# EAGLE design gant_indus_050213 (EAGLE 5.12)
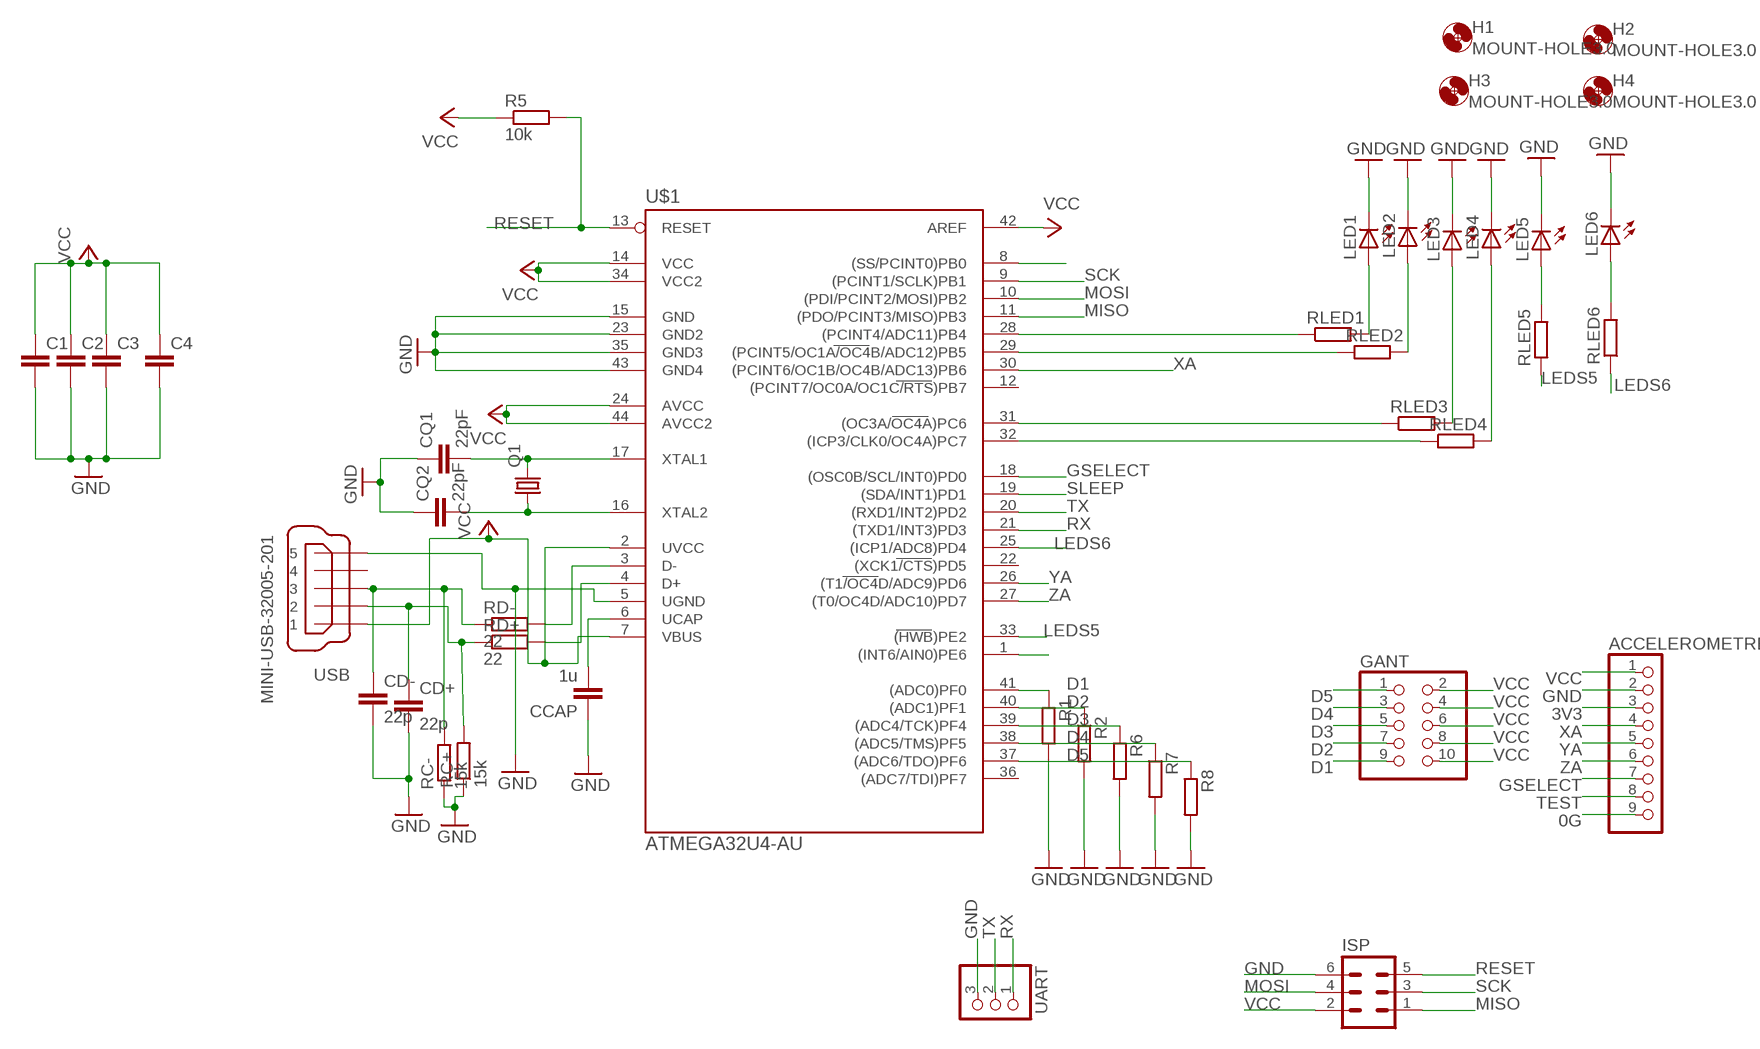
[diagram p0: schematic, sheet 1]

## Parts
ACCELEROMETRE  PINHD-1X9  [1X09]
C1  C-EUC0805  [C0805]
C2  C-EUC0805  [C0805]
C3  C-EUC0805  [C0805]
C4  C-EUC0805  [C0805]
CCAP  1u  C-EUC0805  [C0805]
CD+  22p  C-EUC0805  [C0805]
CD-  22p  C-EUC0805  [C0805]
CQ1  22pF  C-EUC0805  [C0805]
CQ2  22pF  C-EUC0805  [C0805]
GANT  PINHD-2X5/90  [2X05/90]
H1  MOUNT-HOLE3.0  [3,0]
H2  MOUNT-HOLE3.0  [3,0]
H3  MOUNT-HOLE3.0  [3,0]
H4  MOUNT-HOLE3.0  [3,0]
ISP  ML6L  [ML6L]
LED1  LEDCHIP-LED0805  [CHIP-LED0805]
LED2  LEDCHIP-LED0805  [CHIP-LED0805]
LED3  LEDCHIP-LED0805  [CHIP-LED0805]
LED4  LEDCHIP-LED0805  [CHIP-LED0805]
LED5  LEDCHIP-LED0805  [CHIP-LED0805]
LED6  LEDCHIP-LED0805  [CHIP-LED0805]
Q1  CRYSTALHC49U70  [HC49U70]
R1  R-EU_R0805  [R0805]
R2  R-EU_R0805  [R0805]
R5  10k  R-EU_R0805  [R0805]
R6  R-EU_R0805  [R0805]
R7  R-EU_R0805  [R0805]
R8  R-EU_R0805  [R0805]
RC+  15k  R-EU_M0805  [M0805]
RC-  15k  R-EU_M0805  [M0805]
RD+  22  R-EU_M0805  [M0805]
RD-  22  R-EU_M0805  [M0805]
RLED1  R-EU_M0805  [M0805]
RLED2  R-EU_M0805  [M0805]
RLED3  R-EU_M0805  [M0805]
RLED4  R-EU_M0805  [M0805]
RLED5  R-EU_M0805  [M0805]
RLED6  R-EU_M0805  [M0805]
U$1  ATMEGA32U4-AU  [TQFP44]
UART  PINHD-1X3  [1X03]
USB  MINI-USB-32005-201  [32005-201]

## Nets
0G: ACCELEROMETRE.9
3V3: ACCELEROMETRE.3
D1: GANT.9 R1.1 U$1.41((ADC0)PF0)
D2: GANT.7 R2.1 U$1.40((ADC1)PF1)
D3: GANT.5 R6.1 U$1.39((ADC4/TCK)PF4)
D4: GANT.3 R7.1 U$1.38((ADC5/TMS)PF5)
D5: GANT.1 R8.1 U$1.37((ADC6/TDO)PF6)
D+: CD+.1 RC+.2 RD+.1 USB.2
D-: CD-.1 RC-.2 RD-.1 USB.3
GND: ACCELEROMETRE.2 C1.2 C2.2 C3.2 C4.2 CCAP.1 CD+.2 CD-.2 CQ1.1 CQ2.1 ISP.6 LED1.C LED2.C LED3.C LED4.C LED5.C LED6.C R1.2 R2.2 R6.2 R7.2 R8.2 RC+.1 RC-.1 U$1.5(UGND) U$1.15(GND) U$1.23(GND2) U$1.35(GND3) U$1.43(GND4) UART.3 USB.5
GSELECT: ACCELEROMETRE.7 U$1.18((OSC0B/SCL/INT0)PD0)
LEDS5: RLED5.1 U$1.33((HWB)PE2)
LEDS6: RLED6.1 U$1.25((ICP1/ADC8)PD4)
MISO: ISP.1 U$1.11((PDO/PCINT3/MISO)PB3)
MOSI: ISP.4 U$1.10((PDI/PCINT2/MOSI)PB2)
N$3: LED6.A RLED6.2
N$5: CQ1.2 Q1.2 U$1.17(XTAL1)
N$6: LED1.A RLED1.2
N$7: CQ2.2 Q1.1 U$1.16(XTAL2)
N$10: RD-.2 U$1.3(D-)
N$11: RD+.2 U$1.4(D+)
N$13: LED2.A RLED2.2
N$16: LED4.A RLED4.2
N$19: LED5.A RLED5.2
N$20: LED3.A RLED3.2
N$21: RLED1.1 U$1.28((PCINT4/ADC11)PB4)
N$22: RLED2.1 U$1.29((PCINT5/OC1A/OC4B/ADC12)PB5)
N$23: RLED3.1 U$1.31((OC3A/OC4A)PC6)
N$25: RLED4.1 U$1.32((ICP3/CLK0/OC4A)PC7)
N$27: U$1.8((SS/PCINT0)PB0)
N$29: U$1.1((INT6/AIN0)PE6)
N$31: CCAP.2 U$1.6(UCAP)
RESET: ISP.5 R5.2 U$1.13(RESET)
RX: U$1.21((TXD1/INT3)PD3) UART.1
SCK: ISP.3 U$1.9((PCINT1/SCLK)PB1)
SLEEP: U$1.19((SDA/INT1)PD1)
TEST: ACCELEROMETRE.8
TX: U$1.20((RXD1/INT2)PD2) UART.2
VCC: ACCELEROMETRE.1 C1.1 C2.1 C3.1 C4.1 GANT.2 GANT.4 GANT.6 GANT.8 GANT.10 ISP.2 R5.1 U$1.2(UVCC) U$1.7(VBUS) U$1.14(VCC) U$1.24(AVCC) U$1.34(VCC2) U$1.42(AREF) U$1.44(AVCC2) USB.1
XA: ACCELEROMETRE.4 U$1.30((PCINT6/OC1B/OC4B/ADC13)PB6)
YA: ACCELEROMETRE.5 U$1.26((T1/OC4D/ADC9)PD6)
ZA: ACCELEROMETRE.6 U$1.27((T0/OC4D/ADC10)PD7)
Unconnected: U$1.12((PCINT7/OC0A/OC1C/RTS)PB7) U$1.22((XCK1/CTS)PD5) U$1.36((ADC7/TDI)PF7) USB.4

## Library data of the parts
ACCELEROMETRE = pinhead:PINHD-1X9: PIN HEADER
C1-C4 CCAP CD+ CD- CQ1 CQ2 = rcl:C-EU: CAPACITOR, European symbol
GANT = pinhead:PINHD-2X5: PIN HEADER
H1-H4 = holes:MOUNT-HOLE: MOUNTING HOLE with drill center marker
ISP = con-harting-ml:ML6: HARTING; OC_FARNELL: unknown; OC_NEWARK: unknown
LED1-LED6 = led:LED: LED OSRAM: - CHIPLED LG R971, LG N971, LY N971, LG Q971, LY Q971, LO R971, LY R971 LH N974, LH R974 LS Q976, LO Q976, LY Q976 LO Q996 - Hyper CHIPLED LW Q18S LB Q993, LB Q99A, LB R99A - SideLED LS A670, LO A670, LY A670, LG A670, LP A670 LB A673, LV A673, LT A673, LW A673 LH A674 LY A675 LS A676, LA A676, LO A676, LY A676, LW A676 LS A679, LY A679, LG A679 - Hyper Micro SIDELED® LS Y876, LA Y876, LO Y876, LY Y876 LT Y87S - SmartLED LW L88C, LW L88S LB L89C, LB L89S, LG L890 LS L89K, LO L89K, LY L89K LS L896, LA L896, LO L896, LY L896 - TOPLED LS T670, LO T670, LY T670, LG T670, LP T670 LSG T670, LSP T670, LSY T670, LOP T670, LYG T670 LG T671, LOG T671, LSG T671 LB T673, LV T673, LT T673, LW T673 LH T674 LS T676, LA T676, LO T676, LY T676, LB T676, LH T676, LSB T676, LW T676 LB T67C, LV T67C, LT T67C, LS T67K, LO T67K, LY T67K, LW E67C LS E67B, LA E67B, LO E67B, LY E67B, LB E67C, LV E67C, LT E67C LW T67C LS T679, LY T679, LG T679 LS T770, LO T770, LY T770, LG T770, LP T770 LB T773, LV T773, LT T773, LW T773 LH T774 LS E675, LA E675, LY E675, LS T675 LS T776, LA T776, LO T776, LY T776, LB T776 LHGB T686 LT T68C, LB T68C - Hyper Mini TOPLED® LB M676 - Mini TOPLED Santana® LG M470 LS M47K, LO M47K, LY M47K Source: http://www.osram.convergy.de LUXEON: - LUMILED® LXK2-PW12-R00, LXK2-PW12-S00, LXK2-PW14-U00, LXK2-PW14-V00 LXK2-PM12-R00, LXK2-PM12-S00, LXK2-PM14-U00 LXK2-PE12-Q00, LXK2-PE12-R00, LXK2-PE12-S00, LXK2-PE14-T00, LXK2-PE14-U00 LXK2-PB12-K00, LXK2-PB12-L00, LXK2-PB12-M00, LXK2-PB14-N00, LXK2-PB14-P00, LXK2-PB14-Q00 LXK2-PR12-L00, LXK2-PR12-M00, LXK2-PR14-Q00, LXK2-PR14-R00 LXK2-PD12-Q00, LXK2-PD12-R00, LXK2-PD12-S00 LXK2-PH12-R00, LXK2-PH12-S00 LXK2-PL12-P00, LXK2-PL12-Q00, LXK2-PL12-R00 Source: www.luxeon.com KINGBRIGHT: KA-3528ASYC Source: www.kingbright.com
Q1 = crystal:CRYSTAL: CRYSTAL; OC_FARNELL: unknown; OC_NEWARK: unknown
R1 R2 R5-R8 RD+ RD- RLED1-RLED6 = rcl:R-EU_: RESISTOR, European symbol
RC+ RC- = resistor:R-EU_: RESISTOR, European symbol
U$1 = mega32U4:ATMEGA32U4-AU
UART = pinhead:PINHD-1X3: PIN HEADER
USB = con-cypressindustries:MINI-USB-: MINI USB-B Conector Source: www.cypressindustries.com; OC_FARNELL: unknown; OC_NEWARK: unknown

## Board
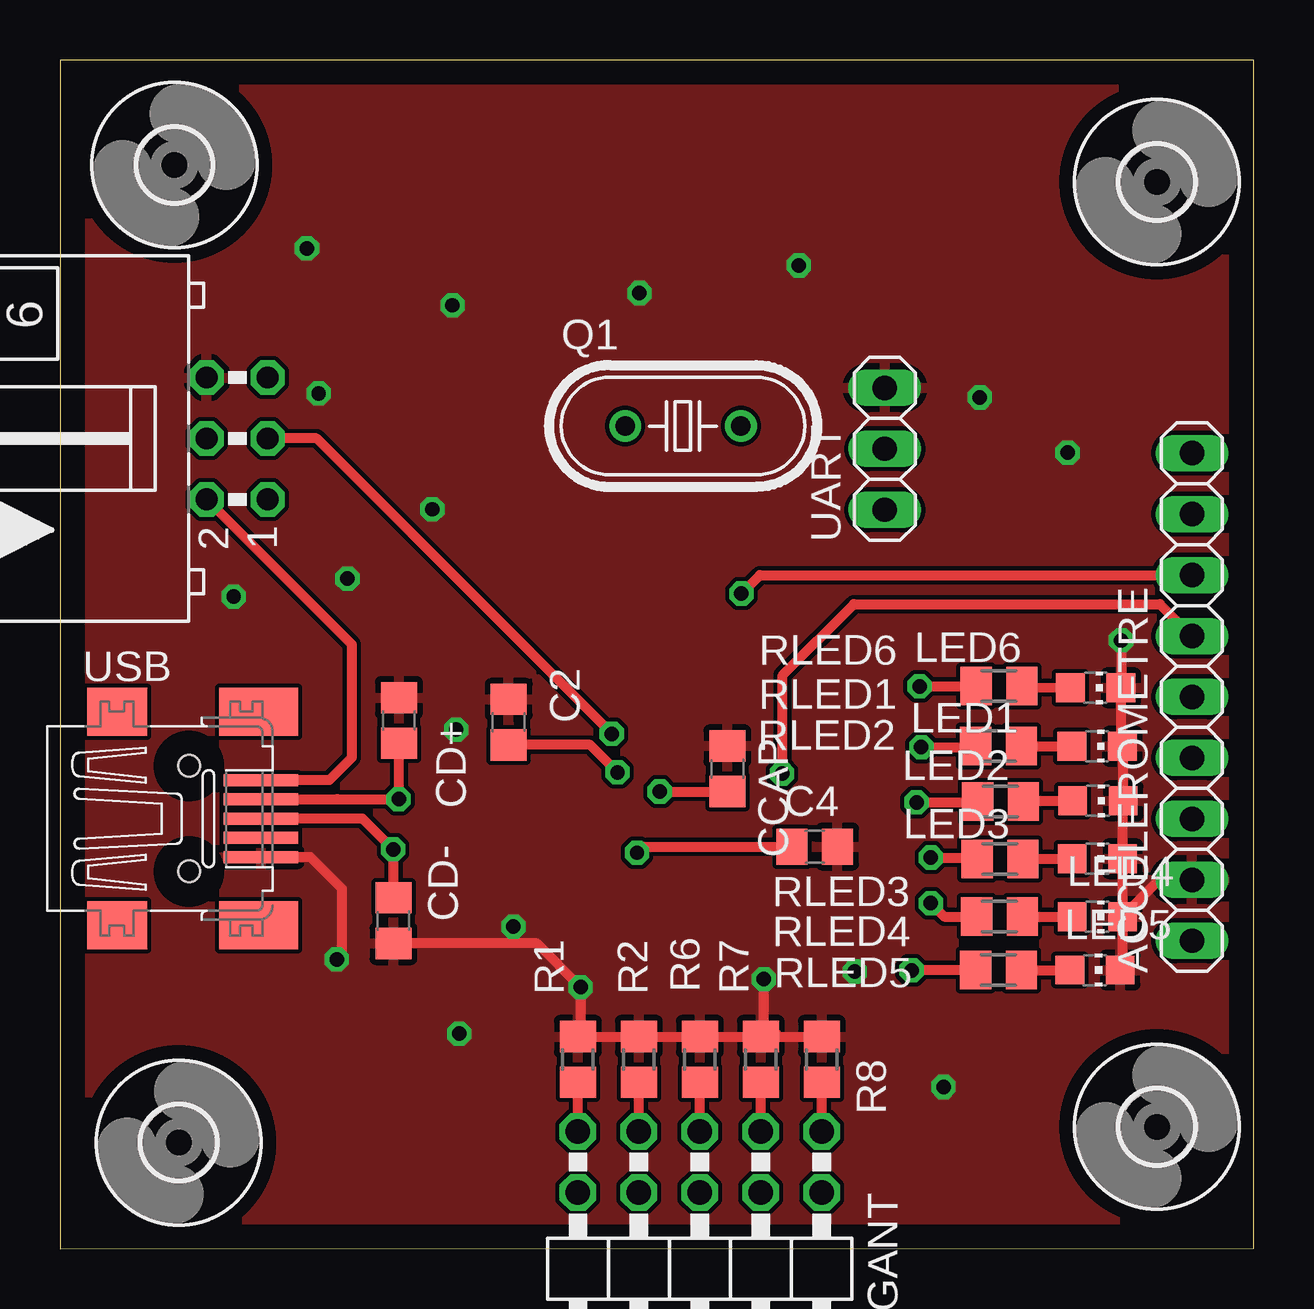
[diagram p1: board, top side]
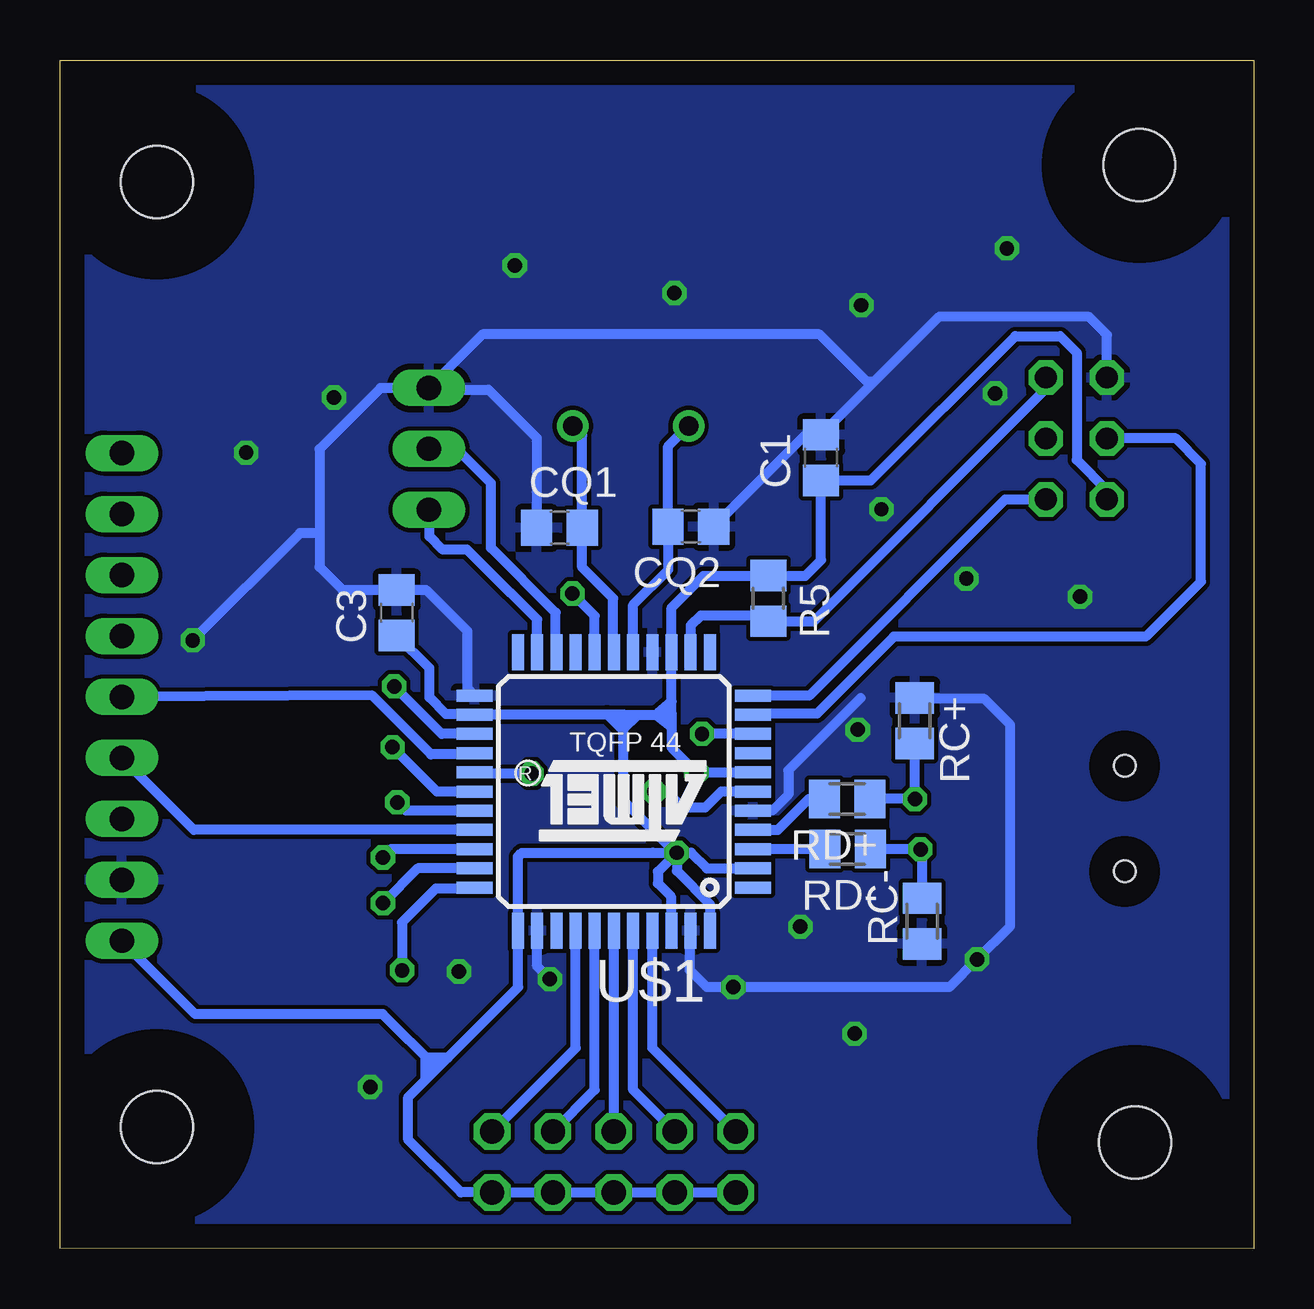
[diagram p2: board, bottom side, seen from below]

Size 49.76 x 49.53 mm. Coordinates in mm from the lower left corner, seen from the top.
Outline: 0,0 49.76,0.01 49.76,49.53 0,49.52 0,0
Copper layers (1*16): Top 0.035mm / dielectric 1.5mm / Bottom 0.035mm
Design rules "default *": minimum track width 10mil, minimum drill 0.6mm, track to track 7mil, track to pad 7mil, pad to pad 7mil, via to via 7mil, smd to smd 0mil, copper to edge 40mil, drill to drill 8mil, minimum pad ring 10mil, minimum via ring 8mil, stop-mask expansion 4mil, vias tented up to drill 0mil, thermal gap 10mil

### Footprints (pad centres in the part's own frame; a part is rotated, then mirrored left to right if it is on the bottom)
1X09 = drill 1.016 long: 1 -10.16,0; 2 -7.62,0; 3 -5.08,0; 4 -2.54,0; 5 0,0; 6 2.54,0; 7 5.08,0; 8 7.62,0; 9 10.16,0
C0805 = smd 1.3 x 1.5: 1 -0.95,0; 2 0.95,0
2X05/90 = drill 1.016 octagon: 1 -5.08,-6.35; 2 -5.08,-3.81; 3 -2.54,-6.35; 4 -2.54,-3.81; 5 0,-6.35; 6 0,-3.81; 7 2.54,-6.35; 8 2.54,-3.81; 9 5.08,-6.35; 10 5.08,-3.81
3,0 = hole 3: 0,0
ML6L = drill 0.914 octagon: 1 -2.54,-1.27; 2 -2.54,1.27; 3 0,-1.27; 4 0,1.27; 5 2.54,-1.27; 6 2.54,1.27
CHIP-LED0805 = smd 1.2 x 1.2: A 0,-1.05; C 0,1.05
HC49U70 = drill 0.813 round: 1 -2.413,0; 2 2.413,0
R0805 = smd 1.3 x 1.5: 1 -0.95,0; 2 0.95,0
M0805 = smd 1.3 x 1.6: 1 -0.95,0; 2 0.95,0
TQFP44 = smd 1.5 x 0.5: 1 -5.8,4; 2 -5.8,3.2; 3 -5.8,2.4; 4 -5.8,1.6; 5 -5.8,0.8; 6 -5.8,0; 7 -5.8,-0.8; 8 -5.8,-1.6; 9 -5.8,-2.4; 10 -5.8,-3.2; 11 -5.8,-4; 23 5.8,-4; 24 5.8,-3.2; 25 5.8,-2.4; 26 5.8,-1.6; 27 5.8,-0.8; 28 5.8,0; 29 5.8,0.8; 30 5.8,1.6; 31 5.8,2.4; 32 5.8,3.2; 33 5.8,4 | smd 0.5 x 1.5: 12 -4,-5.8; 13 -3.2,-5.8; 14 -2.4,-5.8; 15 -1.6,-5.8; 16 -0.8,-5.8; 17 0,-5.8; 18 0.8,-5.8; 19 1.6,-5.8; 20 2.4,-5.8; 21 3.2,-5.8; 22 4,-5.8; 34 4,5.8; 35 3.2,5.8; 36 2.4,5.8; 37 1.6,5.8; 38 0.8,5.8; 39 0,5.8; 40 -0.8,5.8; 41 -1.6,5.8; 42 -2.4,5.8; 43 -3.2,5.8; 44 -4,5.8
1X03 = drill 1.016 long: 1 -2.54,0; 2 0,0; 3 2.54,0
32005-201 = smd 3.1 x 0.5: 1 3,1.6; 2 3,0.8; 3 3,0; 4 3,-0.8; 5 3,-1.6 | smd 2.5 x 2: M1 -3,-4.45; M2 -3,4.45 | smd 3.3 x 2: M3 2.9,4.45; M4 2.9,-4.45 | hole 0.9: 0,2.2; 0,-2.2

### Placement (x,y rotation side)
ACCELEROMETRE  47.18,22.99 90 top
C1  18.04,32.96 90 bottom
C2  18.7,21.94 90 top
C3  35.72,26.5 90 bottom
C4  31.46,16.75 0 top
CCAP  27.82,20 270 top
CD+  14.13,22.01 90 top
CD-  13.9,13.67 270 top
CQ1  28.94,30.04 0 bottom
CQ2  23.46,30.09 180 bottom
GANT  26.67,-1.47 180 top
H1  4.95,4.42 0 top
H2  45.72,5.08 0 top
H3  45.72,44.45 0 top
H4  4.77,45.15 0 top
ISP  7.39,33.76 90 top
LED1  43.23,20.94 270 top
LED2  43.26,18.66 270 top
LED3  43.24,16.25 270 top
LED4  43.24,13.83 270 top
LED5  43.14,11.61 270 top
LED6  43.17,23.37 270 top
Q1  25.97,34.28 0 top
R1  21.59,7.89 90 top
R2  24.13,7.89 90 top
R5  20.23,27.1 270 bottom
R6  26.67,7.89 90 top
R7  29.21,7.89 90 top
R8  31.75,7.89 90 top
RC+  14.13,22 270 bottom
RC-  13.83,13.65 90 bottom
RD+  16.95,18.74 180 bottom
RD-  16.93,16.65 180 bottom
RLED1  39.12,20.94 0 top
RLED2  39.2,18.64 0 top
RLED3  39.18,16.24 0 top
RLED4  39.16,13.84 0 top
RLED5  39.12,11.62 0 top
RLED6  39.14,23.44 0 top
U$1  26.67,19.05 180 bottom
UART  34.38,33.33 90 top
USB  5.38,17.92 0 top

### Tracks (layer width: path | path; a pad name or v marks a point on that pad's centre or on a via)
D1
  Top 0.406: GANT.9 R1.1
  Bottom 0.406: GANT.9 25.07,8.36 U$1.41
D2
  Top 0.406: GANT.7 R2.1
  Bottom 0.406: 24.1,4.91 GANT.7 25.87,6.62 U$1.40
D3
  Top 0.406: GANT.5 R6.1
  Bottom 0.406: GANT.5 U$1.39
D4
  Top 0.406: GANT.3 R7.1
  Bottom 0.406: U$1.38 27.47,6.62 GANT.3
D5
  Top 0.406: GANT.1 R8.1
  Bottom 0.406: U$1.37 28.27,8.36 GANT.1
D+  (via drill 0.6)
  Top 0.406: USB.2 11.55,18.73 | 11.55,18.73 v14.12,18.73 | v14.12,18.73 v14.13,18.74 | 11.55,18.73 11.56,18.74 | CD+.1 14.14,18.75 v14.12,18.73
  Bottom 0.406: v14.13,18.74 RD+.1 | v14.13,18.74 RC+.2 | v14.12,18.73 v14.13,18.74
D-  (via drill 0.6)
  Top 0.406: CD-.1 v13.9,16.63 v13.89,16.64 12.61,17.92 USB.3
  Bottom 0.406: RD-.1 v13.89,16.64 13.83,16.58 RC-.2
GND  (via drill 0.6)
  Top 0.406: 21.7,8.84 R1.2 | 21.7,8.84 v21.7,10.9 19.88,12.72 CD-.2 | LED5.C 44.29,11.71 LED4.C | LED4.C LED3.C 44.29,18.64 LED2.C 44.31,20.91 LED1.C 44.22,21 LED6.C v44.23,25.35 | 21.7,8.84 R2.2 R6.2 R7.2 | R7.2 29.73,8.84 | 29.73,8.84 R8.2 | 29.73,8.84 29.86,8.97 | v29.34,11.23 29.34,8.97 R7.2 | USB.5 10.44,16.32 11.76,15 11.76,12.28 v11.54,12.05 | ACCELEROMETRE.2 45.83,15.37 LED4.C
  Bottom 0.406: U$1.43 23.5,13.22 23.5,11.6 22.8,10.9 v21.7,10.9 12.69,10.9 v11.54,12.05 10.15,13.44 10.15,21.83 11.23,22.91 14.09,22.91 RC+.1 | 15.82,36.12 C1.2 18.69,33.91 CQ2.1 | UART.3 32.15,38.1 18.1,38.1 16.12,36.12 15.82,36.12 | CQ1.1 29.89,33.79 31.9,35.8 34.31,35.8 UART.3 | U$1.23 32.79,23.37 32.79,25.74 34.5,27.45 C3.2 37.98,27.45 38.94,28.41 38.94,29.82 | 38.94,29.82 38.94,33.32 36.4,35.86 UART.3 | ISP.6 6.12,38.08 6.87,38.83 13.12,38.83 15.82,36.12 | U$1.35 29.87,11.76 v29.34,11.23 | U$1.5 20.07,18.25 19.4,18.92 19.4,19.93 16.38,22.95 | v44.23,25.35 39.76,29.82 38.94,29.82
  other vias: 16.64,8.96 18.9,13.42 33.13,11.55 36.83,6.74 42,33.17 38.34,35.47 30.8,40.97 24.15,39.82 16.36,39.31 10.29,41.68 10.78,35.64 15.52,30.81 11.98,27.92 7.24,27.17 16.51,21.63
  pour Bottom: 0,49.52 0,0 50.48,0 50.48,49.52
  pour Top: 0.02,49.52 50.47,49.52 50.47,0.01 0.02,0.01
GSELECT  (via drill 0.6)
  Top 0.406: ACCELEROMETRE.7 29.17,28.07 v28.4,27.3
  Bottom 0.406: v28.4,27.3 27.47,26.37 U$1.18
LEDS5  (via drill 0.6)
  Top 0.406: RLED5.1 35.52,11.62 v35.5,11.6
  Bottom 0.406: v35.5,11.6 35.5,13.6 34.1,15 32.52,15 U$1.33
LEDS6  (via drill 0.6)
  Top 0.406: v35.83,23.43 RLED6.1
  Bottom 0.406: U$1.25 33.85,21.45 v35.83,23.43
MISO
  Bottom 0.406: U$1.11 18.53,23.05 10.37,31.21 ISP.1
MOSI
  Bottom 0.406: ISP.4 3.26,33.76 2.2,32.7 2.2,27.8 4.5,25.5 15,25.5 18.2,22.3 20.82,22.3 U$1.10
N$2
  Bottom 0.406: 24.85,22.21 24.28,21.75
N$3
  Top 0.406: RLED6.2 40.14,23.39 LED6.A
N$4
  Bottom 0.406: 26.31,21.78 26.75,22.18
N$5
  Bottom 0.406: U$1.17 26.7,24.88 26.7,27.1 27.99,28.39 CQ1.2 27.99,33.89 Q1.2
N$6
  Top 0.406: RLED1.2 LED1.A
N$7
  Bottom 0.406: U$1.16 25.87,26.83 24.4,28.3 CQ2.2 24.41,33.43 Q1.1
N$8
  Bottom 0.406: 26.28,21.66 25.71,22.2
N$9
  Bottom 0.406: 26.3,21.6 26.95,22.26
N$10
  Bottom 0.406: RD-.2 U$1.3
N$11
  Bottom 0.406: RD+.2 18.55,18.74 19.85,17.44 U$1.4
N$13
  Top 0.406: RLED2.2 40.18,18.67 LED2.A
N$16
  Top 0.406: RLED4.2 LED4.A
N$18
  Bottom 0.406: 34.2,7.83 33.75,7.83 33.74,7.84
N$19
  Top 0.406: RLED5.2 LED5.A
N$20
  Top 0.406: RLED3.2 LED3.A
N$21  (via drill 0.6)
  Top 0.406: v35.9,20.9 38.13,20.9 RLED1.1
  Bottom 0.406: U$1.28 34.05,19.05 v35.9,20.9
N$22  (via drill 0.6)
  Top 0.406: v35.7,18.6 38.21,18.6 RLED2.1
  Bottom 0.406: U$1.29 35.35,18.25 v35.7,18.6
N$23  (via drill 0.6)
  Top 0.406: RLED3.1 38.17,16.3 v36.3,16.3
  Bottom 0.406: v36.3,16.3 35.95,16.65 U$1.31
N$25  (via drill 0.6)
  Top 0.406: RLED4.1 36.86,13.84 v36.3,14.4
  Bottom 0.406: v36.3,14.4 34.85,15.85 U$1.32
N$28
  Bottom 0.406: 34.41,7.18 34.41,7.95 33.6,7.95 33.59,7.96 34.49,7.96 34.52,7.93 34.52,7.08
N$31  (via drill 0.6)
  Top 0.406: v25,19.05 CCAP.2
  Bottom 0.406: v25,19.05 24.47,19.05 23.8,18.38 22.87,18.38 22.2,19.05 U$1.6
RESET
  Bottom 0.406: U$1.13 23.47,25.97 23.06,26.38 20.46,26.38 R5.2 20.21,26.13 18.36,26.13 8.66,35.83 ISP.5
RX
  Bottom 0.406: U$1.21 29.87,26.22 31,27.35 31.02,27.35 32.8,29.13 33.81,29.13 34.36,29.68 34.36,30.77 UART.1
SCK  (via drill 0.6)
  Top 0.406: ISP.3 10.69,33.76 v23,21.45
  Bottom 0.406: U$1.9 v23,21.45
TX
  Bottom 0.406: UART.2 33.23,33.33 31.8,31.9 31.8,29.2 29.1,26.5 29.1,24.88 U$1.20
VCC  (via drill 0.6)
  Top 0.406: USB.1 11.22,19.52 12.16,20.46 12.16,25.18 ISP.2 | C2.1 22.1,20.99 v23.24,19.85 | C4.1 24.3,16.75 v24.05,16.5
  Bottom 0.406: GANT.10 GANT.8 GANT.6 GANT.4 GANT.2 33.05,2.35 35.24,4.54 35.24,6.32 34.05,7.51 | C3.1 34.36,24.19 34.36,22.97 33.67,22.28 32.5,22.28 U$1.24 26.25,22.25 | ISP.2 6.12,31.61 7.38,32.87 7.38,37.34 8.07,38.03 9.94,38.03 15.96,32.01 C1.1 18.04,28.69 18.69,28.04 R5.1 22.94,28.04 24.27,26.71 U$1.14 24.27,22.8 | 34.05,7.51 30.66,10.9 U$1.34 30.67,16.34 30.52,16.49 25.06,16.49 25.05,16.5 v24.05,16.5 | 34.05,7.51 36.31,9.77 44.12,9.77 ACCELEROMETRE.1 | v23.24,19.85 U$1.7 | 24.27,22.3 24.27,22.8 | 24.27,22.3 24.27,20.88 v23.24,19.85 | 24.76,22.25 24.32,22.25 24.27,22.3 | 26.25,22.25 24.76,22.25 | 24.76,22.25 24.33,22.73 | 24.27,22.8 24.83,22.32 | v23.24,19.85 23.4,19.69 | U$1.2 22.8,15.85 23.45,16.5 v24.05,16.5 | v23.24,19.85 23.45,19.64 | 26.27,21.82 26.27,22.23 26.25,22.25 | 26.27,21.82 25.88,22.21 | U$1.44 22.67,14.36 24.05,15.74 v24.05,16.5 | 26.27,21.82 26.27,18.66 24.11,16.5 v24.05,16.5 | U$1.42 24.3,13.28 24.3,14.68 24.84,15.22 24.84,15.71 v24.05,16.5
XA
  Bottom 0.406: U$1.30 44.18,17.45 ACCELEROMETRE.4
YA
  Bottom 0.406: ACCELEROMETRE.5 36.76,23.06 34.3,20.6 32.52,20.6 U$1.26
ZA  (via drill 0.6)
  Top 0.406: v30.1,19.8 30.12,19.82 30.12,23.89 33.09,26.86 45.85,26.86 ACCELEROMETRE.6
  Bottom 0.406: v30.1,19.8 32.42,19.8 U$1.27